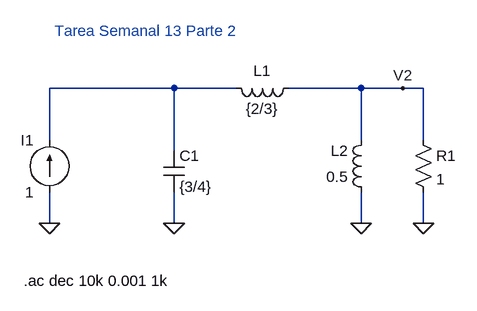
[diagram p0: schematic parte2.asc]
parte2.asc, the LTspice schematic file:
Version 4
SHEET 1 880 680
WIRE 352 256 160 256
WIRE 448 256 352 256
WIRE 640 256 528 256
WIRE 704 256 640 256
WIRE 736 256 704 256
WIRE 160 336 160 256
WIRE 640 336 640 256
WIRE 736 336 736 256
WIRE 352 352 352 256
WIRE 160 464 160 416
WIRE 352 464 352 416
WIRE 640 464 640 416
WIRE 736 464 736 416
FLAG 160 464 0
FLAG 352 464 0
FLAG 640 464 0
FLAG 736 464 0
FLAG 704 256 V2
SYMBOL current 160 416 R180
WINDOW 0 24 80 Left 2
WINDOW 3 24 0 Left 2
SYMATTR InstName I1
SYMATTR Value 1
SYMATTR Value2 AC 1
SYMBOL cap 336 352 R0
SYMATTR InstName C1
SYMATTR Value {3/4}
SYMBOL ind 544 240 R90
WINDOW 0 5 56 VBottom 2
WINDOW 3 32 56 VTop 2
SYMATTR InstName L1
SYMATTR Value {2/3}
SYMBOL ind 656 432 R180
WINDOW 0 36 80 Left 2
WINDOW 3 36 40 Left 2
SYMATTR InstName L2
SYMATTR Value 0.5
SYMBOL res 720 320 R0
SYMATTR InstName R1
SYMATTR Value 1
TEXT 120 552 Left 2 !.ac dec 10k 0.001 1k
TEXT 168 168 Left 2 ;Tarea Semanal 13 Parte 2

The netlist it stands for:
* parte2.asc
I1 0 N001 1 AC 1
C1 N001 0 {3/4}
L1 V2 N001 {2/3}
L2 0 V2 0.5
R1 V2 0 1
.ac dec 10k 0.001 1k
* Tarea Semanal 13 Parte 2
.backanno
.end